# Altium schematic sheet Dribbler.SchDoc
size A4
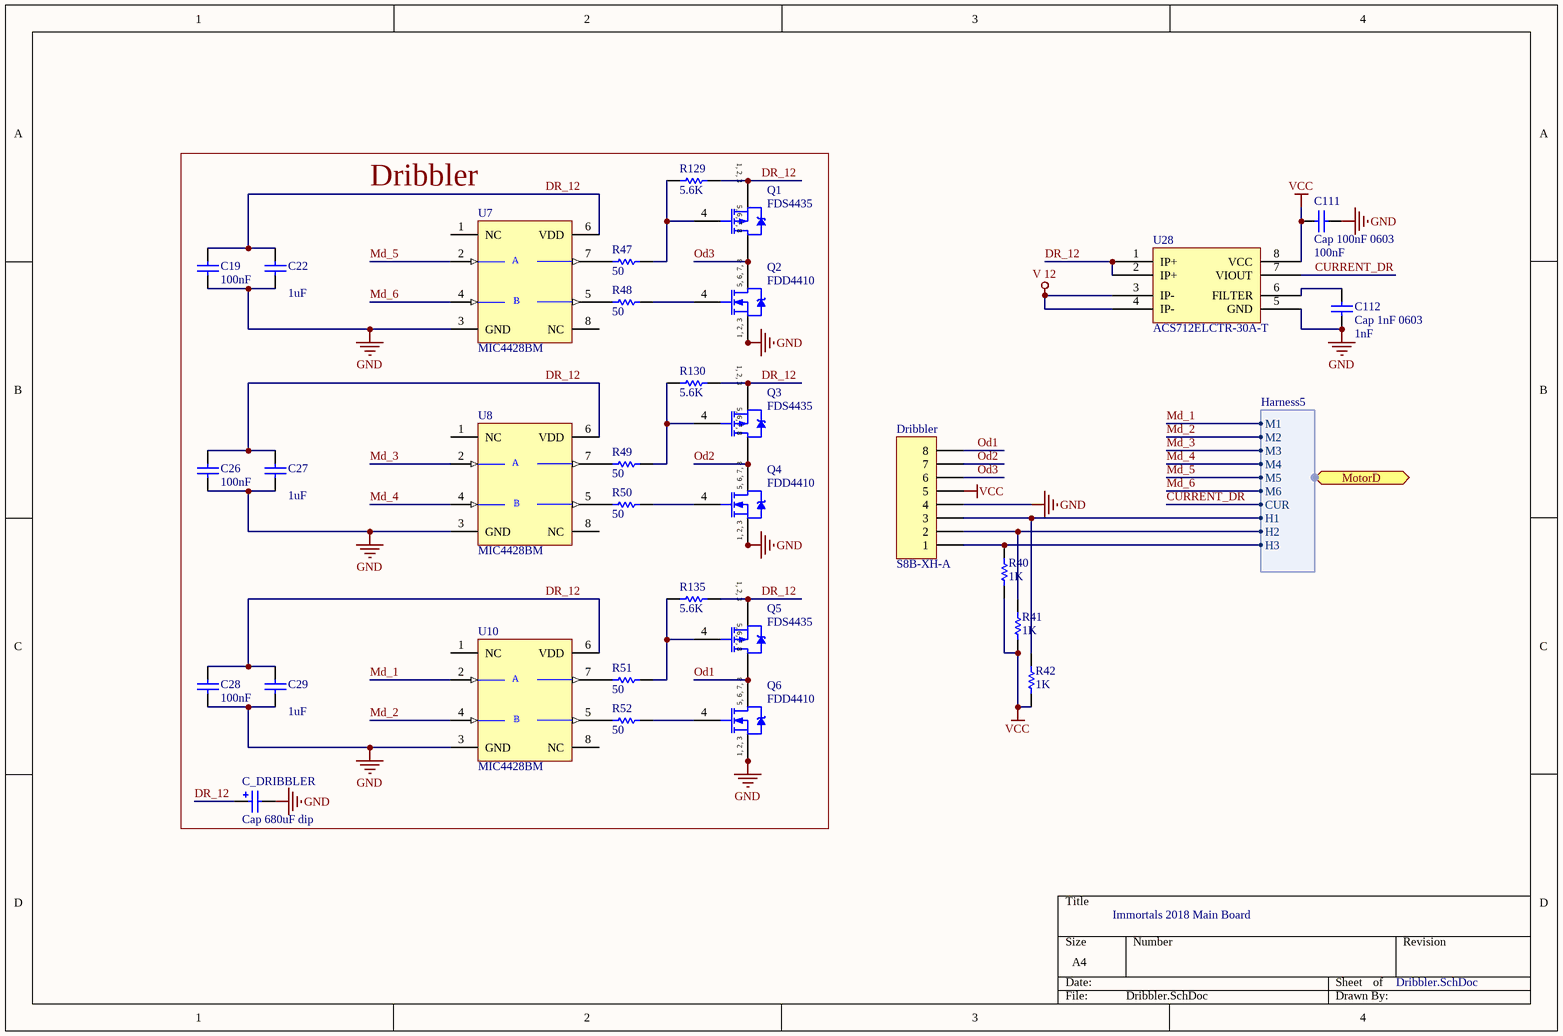
[diagram p0: Dribbler.SchDoc]

## Parts
C19  value 100nF  [1608[0603]]  (hidden comment: Cap 100nF 0603)
C22  value 1uF  [1608[0603]]  (hidden comment: Cap 1uF 0603)
C26  value 100nF  [1608[0603]]  (hidden comment: Cap 100nF 0603)
C27  value 1uF  [1608[0603]]  (hidden comment: Cap 1uF 0603)
C28  value 100nF  [1608[0603]]  (hidden comment: Cap 100nF 0603)
C29  value 1uF  [1608[0603]]  (hidden comment: Cap 1uF 0603)
C111  Cap 100nF 0603  value 100nF  [1608[0603]]
C112  Cap 1nF 0603  value 1nF  [1608[0603]]
C_DRIBBLER  Cap 680uF dip  [CAPPR5-5x5]
Dribbler  S8B-XH-A  [S8B-XH-A-1]
Q1  FDS4435  [SO-8_L]
Q2  FDD4410  [SO-8_L]
Q3  FDS4435  [SO-8_L]
Q4  FDD4410  [SO-8_L]
Q5  FDS4435  [SO-8_L]
Q6  FDD4410  [SO-8_L]
R40  value 1K  [1608[0603]]  (hidden comment: Res 1K 0603)
R41  value 1K  [1608[0603]]  (hidden comment: Res 1K 0603)
R42  value 1K  [1608[0603]]  (hidden comment: Res 1K 0603)
R47  value 50  [1608[0603]]  (hidden comment: Res 50 0603)
R48  value 50  [1608[0603]]  (hidden comment: Res 50 0603)
R49  value 50  [1608[0603]]  (hidden comment: Res 50 0603)
R50  value 50  [1608[0603]]  (hidden comment: Res 50 0603)
R51  value 50  [1608[0603]]  (hidden comment: Res 50 0603)
R52  value 50  [1608[0603]]  (hidden comment: Res 50 0603)
R129  value 5.6K  [1608[0603]]  (hidden comment: Res 5.6K 0603)
R130  value 5.6K  [1608[0603]]  (hidden comment: Res 5.6K 0603)
R135  value 5.6K  [1608[0603]]  (hidden comment: Res 5.6K 0603)
U7  MIC4428BM  [NSO8_L]
U8  MIC4428BM  [NSO8_L]
U10  MIC4428BM  [NSO8_L]
U28  ACS712ELCTR-30A-T  [SOIC_8]

## Blocks framed on the sheet
Dribbler: C19 C22 C26-C29 C_DRIBBLER Q1-Q6 R47-R52 R129 R130 R135 U7 U8 U10

## Ports
MotorD (harness Harness5)

## Harnesses
Harness5: M1, M2, M3, M4, M5, M6, CUR, H1, H2, H3

## Nets
GND: C19.1 C22.1 C26.1 C27.1 C28.1 C29.1 C111.2 C112.2 C_DRIBBLER.2 Dribbler.4 Q2.1(S) Q2.2(S) Q2.3(S) Q4.1(S) Q4.2(S) Q4.3(S) Q6.1(S) Q6.2(S) Q6.3(S) U7.3(GND) U8.3(GND) U10.3(GND) U28.5(GND)
V 12: U28.3(IP-) U28.4(IP-)
VCC: C111.1 Dribbler.5 R40.1 R41.1 R42.1 U28.8(VCC)
CURRENT_DR: U28.7(VIOUT) ; port MotorD.CUR
DR_12: C19.2 C22.2 C26.2 C27.2 C28.2 C29.2 C_DRIBBLER.1 Q1.1(S) Q1.2(S) Q1.3(S) Q3.1(S) Q3.2(S) Q3.3(S) Q5.1(S) Q5.2(S) Q5.3(S) R129.1 R130.1 R135.1 U7.6(VDD) U8.6(VDD) U10.6(VDD) U28.1(IP+) U28.2(IP+)
Md_1: U10.2(INA) ; port MotorD.M1
Md_2: U10.4(INB) ; port MotorD.M2
Md_3: U8.2(INA) ; port MotorD.M3
Md_4: U8.4(INB) ; port MotorD.M4
Md_5: U7.2(INA) ; port MotorD.M5
Md_6: U7.4(INB) ; port MotorD.M6
Od1: Dribbler.8 Q5.5(D) Q5.6(D) Q5.7(D) Q5.8(D) Q6.5(D) Q6.6(D) Q6.7(D) Q6.8(D)
Od2: Dribbler.7 Q3.5(D) Q3.6(D) Q3.7(D) Q3.8(D) Q4.5(D) Q4.6(D) Q4.7(D) Q4.8(D)
Od3: Dribbler.6 Q1.5(D) Q1.6(D) Q1.7(D) Q1.8(D) Q2.5(D) Q2.6(D) Q2.7(D) Q2.8(D)
NetC112_1: C112.1 U28.6(FILTER)
NetDribbler_1: Dribbler.1 R40.2 ; port MotorD.H3
NetDribbler_2: Dribbler.2 R41.2 ; port MotorD.H2
NetDribbler_3: Dribbler.3 R42.2 ; port MotorD.H1
NetQ1_4: Q1.4(G) R47.2 R129.2
NetQ2_4: Q2.4(G) R48.2
NetQ3_4: Q3.4(G) R49.2 R130.2
NetQ4_4: Q4.4(G) R50.2
NetQ5_4: Q5.4(G) R51.2 R135.2
NetQ6_4: Q6.4(G) R52.2
NetR47_1: R47.1 U7.7(OUTA)
NetR48_1: R48.1 U7.5(OUTB)
NetR49_1: R49.1 U8.7(OUTA)
NetR50_1: R50.1 U8.5(OUTB)
NetR51_1: R51.1 U10.7(OUTA)
NetR52_1: R52.1 U10.5(OUTB)

Not connected (* = marked no-connect by the designer): U7 1(NC) 8(NC); U8 1(NC) 8(NC); U10 1(NC) 8(NC)

## Notes on the sheet
- Immortals 2018 Main Board
- (in symbol IRF7201) 5, 6, 7, 8; 1, 2, 3
- (in symbol IRF7204) 1, 2, 3; 5, 6, 7, 8
- (in symbol MAX4427CSA) A; B

## Library data of the parts
C19 C22 C26-C29 C111 C112 = Cap Semi: Capacitor (Semiconductor SIM Model); Published: 8-Jun-2000; LatestRevisionDate: 17-Jul-2002; LatestRevisionNote: Re-released for DXP Platform.; PackageReference: C1206; Publisher: Altium Limited
C_DRIBBLER = Cap Pol1: Polarized Capacitor (Radial); Published: 8-Jun-2000; LatestRevisionDate: 17-Jul-2002; LatestRevisionNote: Re-released for DXP Platform.; PackageReference: RB7.6-15; Publisher: Altium Limited; Value: 680uF
Dribbler = 8pin XH
Q1 Q3 Q5 = IRF7204: HEXFET Power MOSFET; Published: 8-Jun-2000; LatestRevisionDate: 13-Apr-2006; LatestRevisionNote: IPC-7351 Footprint Added.; DatasheetVersion: Aug-1997; PackageVersion: Feb-2001; PackageReference: SO-8; Publisher: Altium Limited; PackageDescription: 8-Pin Plastic Small Outline Integrated Circuit 1.27 mm Pitch; Code_JEDEC: MS-012-AA; Code_IPC: SOIC127P600-8; ComponentLink1Description: Manufacturer Link; ComponentLink1URL: http://www.irf.com/; ComponentLink2Description: Datasheet; ComponentLink2URL: http://www.irf.com/product-info/datasheets/data/irf7204.pdf
Q2 Q4 Q6 = IRF7201: HEXFET Power MOSFET; Published: 8-Jun-2000; LatestRevisionDate: 13-Apr-2006; LatestRevisionNote: IPC-7351 Footprint Added.; DatasheetVersion: Sep-1998; PackageVersion: Feb-2001; PackageReference: SO-8; Publisher: Altium Limited; PackageDescription: 8-Pin Plastic Small Outline Integrated Circuit 1.27 mm Pitch; Code_JEDEC: MS-012-AA; Code_IPC: SOIC127P600-8; ComponentLink1Description: Manufacturer Link; ComponentLink1URL: http://www.irf.com/; ComponentLink2Description: Datasheet; ComponentLink2URL: http://www.irf.com/product-info/datasheets/data/irf7201.pdf
R40-R42 R47-R52 R129 R130 R135 = Res Semi: Semiconductor Resistor; Published: 8-Jun-2000; LatestRevisionDate: 17-Jul-2002; LatestRevisionNote: Re-released for DXP Platform.; PackageReference: AXIAL-0.5; Publisher: Altium Limited
U7 U8 U10 = MAX4427CSA: Dual High-Speed 1.5A MOSFET Driver; Published: 16-Jan-2001; LatestRevisionDate: 13-Apr-2006; LatestRevisionNote: IPC-7351 Footprint Added.; DatasheetVersion: Mar-1993; PackageReference: NSO8; Publisher: Altium Limited; PackageDescription: 8-Pin Small Outline Integrated Circuit 1.27 mm Pitch; Code_JEDEC: MS-012-AA; Code_IPC: SOIC127P600-8; ComponentLink1Description: Manufacturer Link; ComponentLink1URL: http://www.maxim-ic.com/; ComponentLink2Description: Datasheet; ComponentLink2URL: http://pdfserv.maxim-ic.com/en/ds/MAX4426-MAX4428.pdf